# Altium schematic sheet WIFI2UART.SchDoc: WIFI2UART.SchDoc
size A4; CheckedBy: fx; Author: flotox@yeah.net; Revision: v1.0.0; SheetNumber: 2; SheetTotal: 10
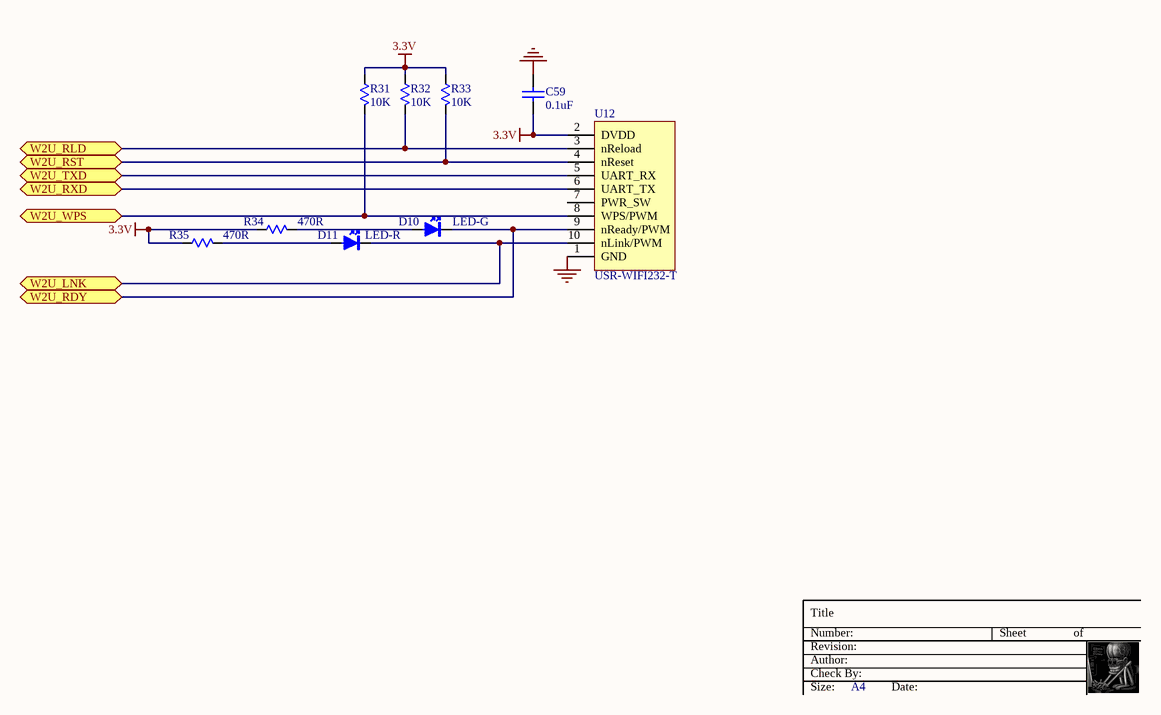
[diagram p0: WIFI2UART.SchDoc]

## Parts
C59  0.1uF  [C0603-S]
D10  LED-G  [LED0603]
D11  LED-R  [LED0603]
R31  10K  [R0603-S]
R32  10K  [R0603-S]
R33  10K  [R0603-S]
R34  470R  [R0603-S]
R35  470R  [R0603-S]
U12  USR-WIFI232-T  [USR-WIFI232-T]

## Ports
W2U_LNK, W2U_RDY, W2U_RLD, W2U_RST, W2U_RXD, W2U_TXD, W2U_WPS

## Nets
3.3V: C59.1 R31.2 R32.2 R33.2 R34.2 R35.2 U12.2(DVDD)
GND: C59.2 U12.1(GND)
W2U_LNK: D11.2(K) U12.10(nLink/PWM) ; port W2U_LNK
W2U_RDY: D10.2(K) U12.9(nReady/PWM) ; port W2U_RDY
W2U_RLD: R32.1 U12.3(nReload) ; port W2U_RLD
W2U_RST: R33.1 U12.4(nReset) ; port W2U_RST
W2U_RXD: U12.6(UART_TX) ; port W2U_RXD
W2U_TXD: U12.5(UART_RX) ; port W2U_TXD
W2U_WPS: R31.1 U12.8(WPS/PWM) ; port W2U_WPS
NetD10_1: D10.1(A) R34.1
NetD11_1: D11.1(A) R35.1

Not connected (* = marked no-connect by the designer): U12 7(PWR_SW)

## Notes on the sheet
- Title
- Revision:
- Number:
- Author:
- Check By:
- Sheet
- of
- Size:
- A4
- Date:

## Library data of the parts
C59 = CAP: Capacitor
D10 D11 = LED: Light Emitting Diode
R31-R35 = RES: Resistor